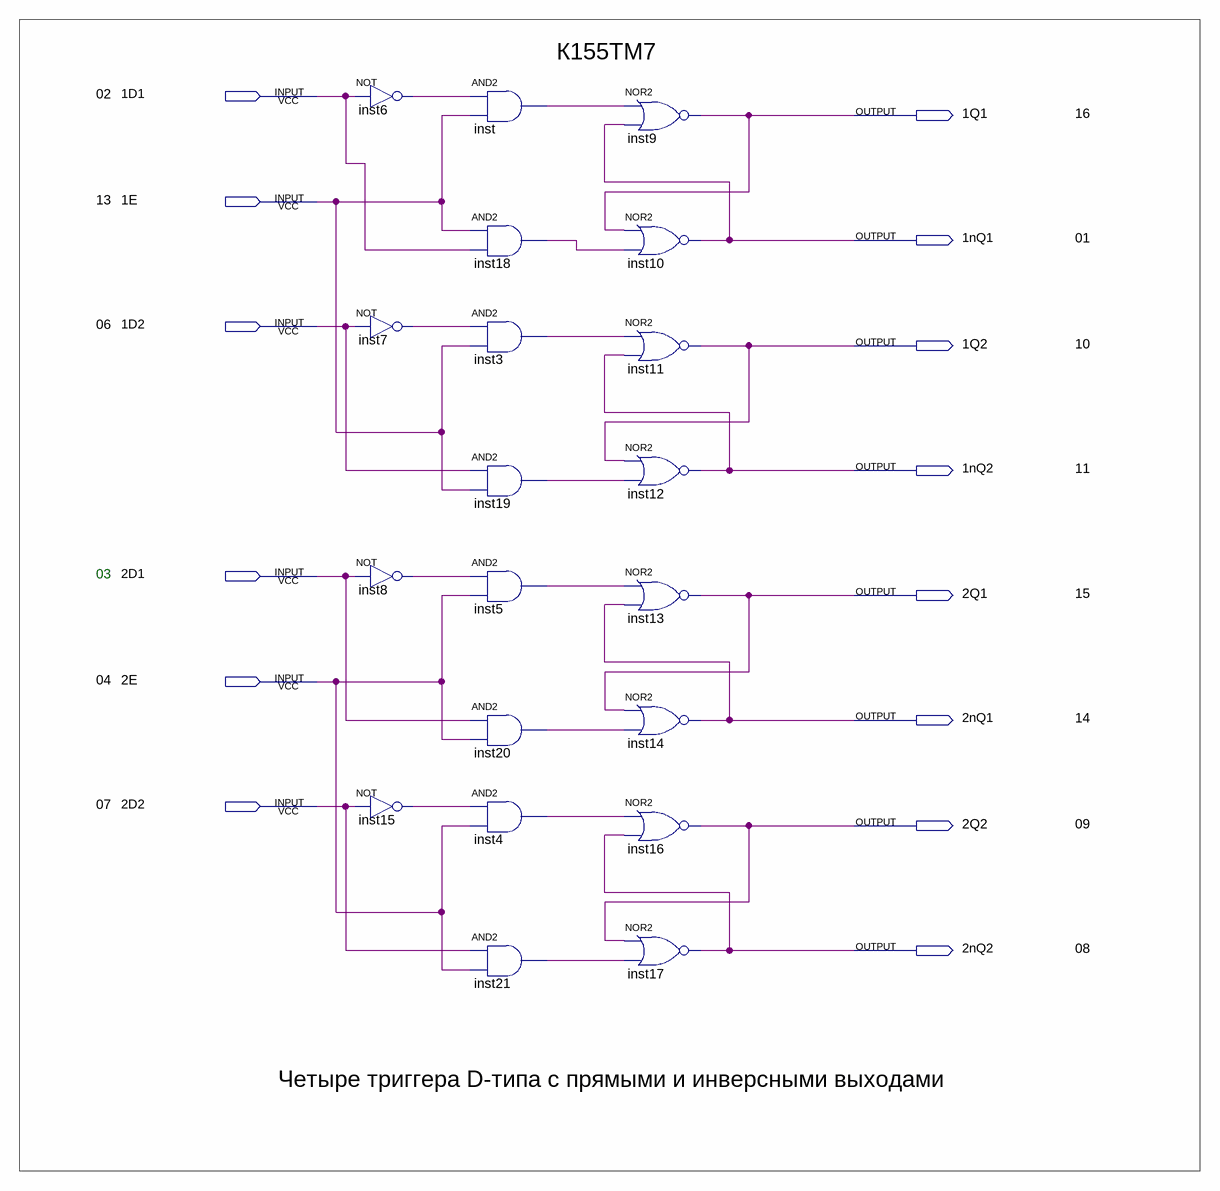
[diagram p0: schematic sheet]
// Quartus schematic K155TM7.bdf as structural Verilog: 20 symbols, 14 pins
module K155TM7 (
  input  \1D1 ,
  input  \1E ,
  input  \1D2 ,
  input  \2D1 ,
  input  \2E ,
  input  \2D2 ,
  output \1Q1 ,
  output \1nQ1 ,
  output \1Q2 ,
  output \1nQ2 ,
  output \2Q1 ,
  output \2nQ1 ,
  output \2Q2 ,
  output \2nQ2 
);

  wire inst3_out, inst4_out, inst5_out, inst6_out, inst7_out, inst8_out, inst15_out, inst18_out, inst19_out,
       inst20_out, inst21_out, inst_out;

  not inst6 (inst6_out, \1D1 );
  not inst7 (inst7_out, \1D2 );
  not inst8 (inst8_out, \2D1 );
  not inst15 (inst15_out, \2D2 );
  and inst (inst_out, inst6_out, \1E );
  and inst18 (inst18_out, \1E , \1D1 );
  and inst3 (inst3_out, inst7_out, \1E );
  and inst19 (inst19_out, \1D2 , \1E );
  and inst5 (inst5_out, inst8_out, \2E );
  and inst20 (inst20_out, \2D1 , \2E );
  and inst4 (inst4_out, inst15_out, \2E );
  and inst21 (inst21_out, \2D2 , \2E );
  nor inst9 (\1Q1 , inst_out, \1nQ1 );
  nor inst10 (\1nQ1 , \1Q1 , inst18_out);
  nor inst11 (\1Q2 , inst3_out, \1nQ2 );
  nor inst12 (\1nQ2 , \1Q2 , inst19_out);
  nor inst13 (\2Q1 , inst5_out, \2nQ1 );
  nor inst14 (\2nQ1 , \2Q1 , inst20_out);
  nor inst16 (\2Q2 , inst4_out, \2nQ2 );
  nor inst17 (\2nQ2 , \2Q2 , inst21_out);

  // Notes on the sheet:
  //   К155ТМ7
  //   02
  //   16
  //   13
  //   01
  //   06
  //   10
  //   11
  //   03
  //   15
  //   04
  //   14
  //   07
  //   09
  //   08
  //   Четыре триггера D-типа с прямыми и инверсными выходами
endmodule
